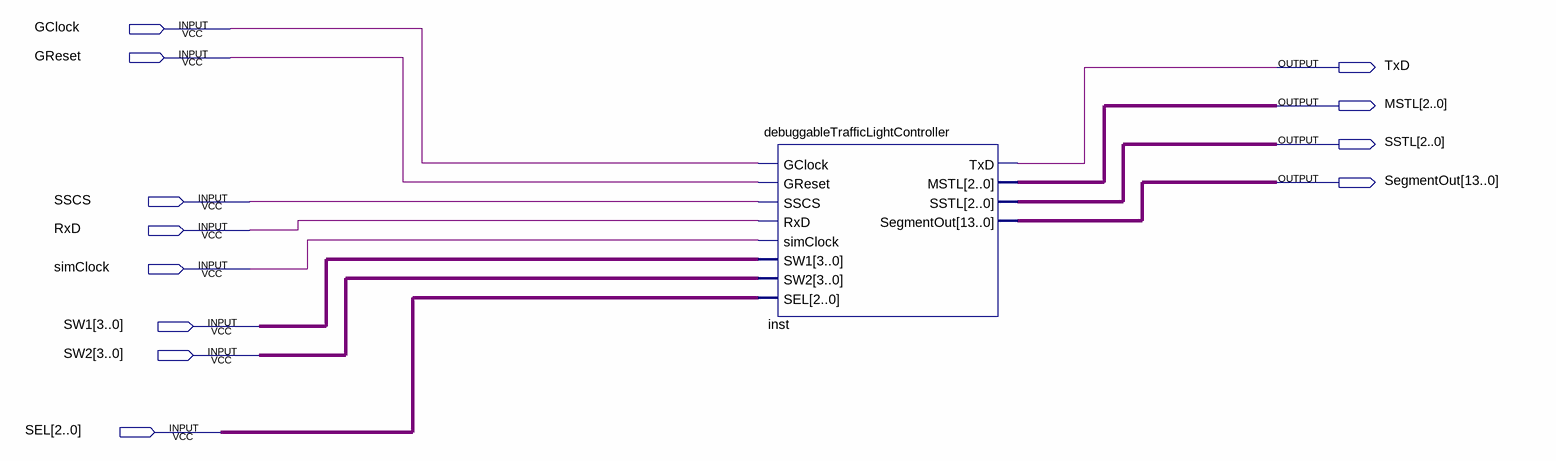
[diagram p0: schematic sheet]
// Quartus schematic projTop.bdf as structural Verilog: 1 symbols, 12 pins
module projTop (
  input  GClock,
  input  GReset,
  input  SSCS,
  input  RxD,
  input  simClock,
  input  [3:0] SW1,
  input  [3:0] SW2,
  input  [2:0] SEL,
  output TxD,
  output [2:0] MSTL,
  output [2:0] SSTL,
  output [13:0] SegmentOut
);

  debuggableTrafficLightController inst (
    .GClock(GClock), .GReset(GReset), .SSCS(SSCS), .RxD(RxD), .simClock(simClock), .SW1(SW1), .SW2(SW2),
    .SEL(SEL), .TxD(TxD), .MSTL(MSTL), .SSTL(SSTL), .SegmentOut(SegmentOut));
endmodule
